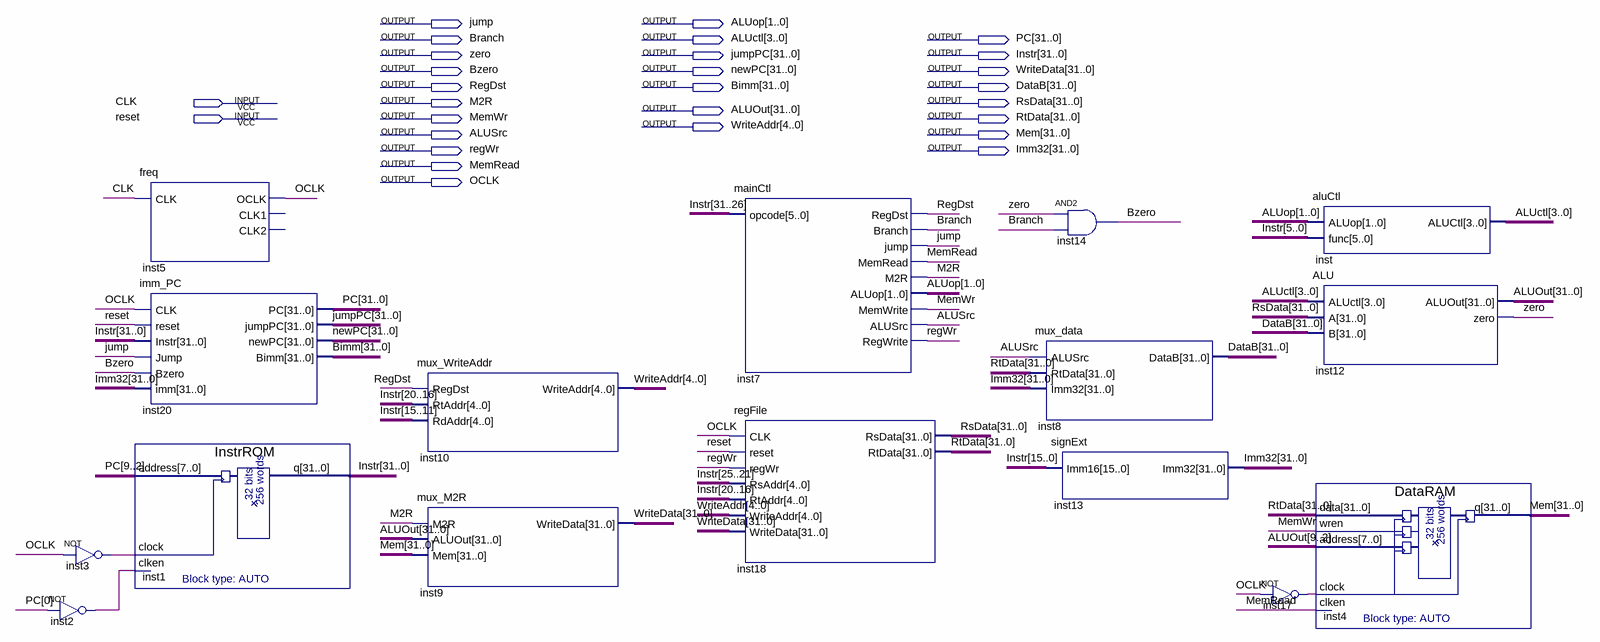
[diagram p0: schematic sheet]
// Quartus schematic SCPU.bdf as structural Verilog: 16 symbols, 28 pins
module SCPU (
  input  CLK,
  input  reset,
  output jump,
  output [1:0] ALUop,
  output Branch,
  output [3:0] ALUctl,
  output [31:0] PC,
  output zero,
  output [31:0] jumpPC,
  output [31:0] Instr,
  output Bzero,
  output [31:0] newPC,
  output [31:0] WriteData,
  output RegDst,
  output [31:0] Bimm,
  output [31:0] DataB,
  output M2R,
  output [31:0] RsData,
  output [31:0] ALUOut,
  output MemWr,
  output [31:0] RtData,
  output [4:0] WriteAddr,
  output ALUSrc,
  output [31:0] Mem,
  output regWr,
  output [31:0] Imm32,
  output MemRead,
  output OCLK
);

  wire inst2_out, inst3_out, inst17_out;

  not inst3 (inst3_out, OCLK);
  not inst2 (inst2_out, PC[0]);
  freq inst5 (.CLK(CLK), .OCLK(OCLK));  // open: CLK1, CLK2
  imm_PC inst20 (
    .CLK(OCLK), .reset(reset), .Instr(Instr), .Jump(jump), .Bzero(Bzero), .imm(Imm32), .PC(PC),
    .jumpPC(jumpPC), .newPC(newPC), .Bimm(Bimm));
  InstrROM inst1 (.address(PC[9:2]), .clock(inst3_out), .clken(inst2_out), .q(Instr));
  mux_WriteAddr inst10 (.RegDst(RegDst), .RtAddr(Instr[20:16]), .RdAddr(Instr[15:11]), .WriteAddr(WriteAddr));
  mux_M2R inst9 (.M2R(M2R), .ALUOut(ALUOut), .Mem(Mem), .WriteData(WriteData));
  mainCtl inst7 (
    .opcode(Instr[31:26]), .RegDst(RegDst), .Branch(Branch), .jump(jump), .MemRead(MemRead), .M2R(M2R),
    .ALUop(ALUop), .MemWrite(MemWr), .ALUSrc(ALUSrc), .RegWrite(regWr));
  regFile inst18 (
    .CLK(OCLK), .reset(reset), .regWr(regWr), .RsAddr(Instr[25:21]), .RtAddr(Instr[20:16]),
    .WriteAddr(WriteAddr), .WriteData(WriteData), .RsData(RsData), .RtData(RtData));
  mux_data inst8 (.ALUSrc(ALUSrc), .RtData(RtData), .Imm32(Imm32), .DataB(DataB));
  signExt inst13 (.Imm16(Instr[15:0]), .Imm32(Imm32));
  and inst14 (Bzero, zero, Branch);
  not inst17 (inst17_out, OCLK);
  aluCtl inst (.ALUop(ALUop), .func(Instr[5:0]), .ALUCtl(ALUctl));
  ALU inst12 (.ALUctl(ALUctl), .A(RsData), .B(DataB), .ALUOut(ALUOut), .zero(zero));
  DataRAM inst4 (.data(RtData), .wren(MemWr), .address(ALUOut[9:2]), .clock(inst17_out), .clken(MemRead), .q(Mem));
endmodule
